# EAGLE design base_rs232 (EAGLE 4.09)
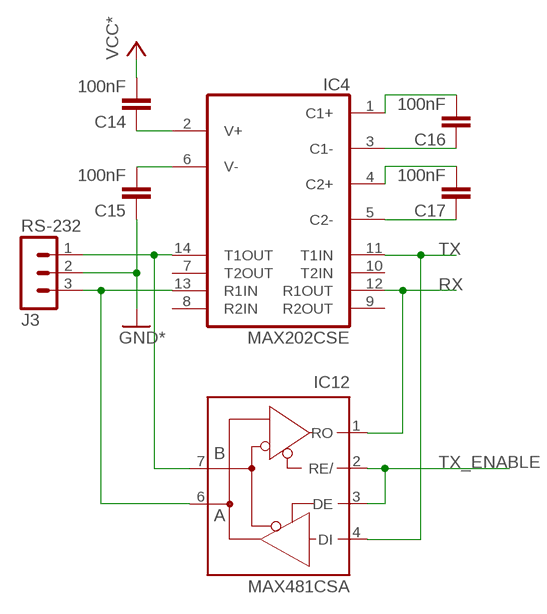
[diagram p0: schematic, sheet 1]

## Parts
C14  100nF  C-EUC0805  [C0805]
C15  100nF  C-EUC0805  [C0805]
C16  100nF  C-EUC0805  [C0805]
C17  100nF  C-EUC0805  [C0805]
IC4  MAX202CSE  [SO16]
IC12  MAX481CSA  [SO08]
J3  RS-232  MA03-1  [MA03-1]

## Nets
GND: C15.2 J3.2 ; supply symbol labelled GND*
LCD_NEG: C15.1 IC4.6(V-)
N$12: IC4.14(T1OUT) IC12.7(B) J3.1
N$16: IC4.13(R1IN) IC12.6(A) J3.3
N$18: C16.2 IC4.3(C1-)
N$20: C17.2 IC4.5(C2-)
N$21: C17.1 IC4.4(C2+)
N$22: C14.2 IC4.2(V+)
N$49: C16.1 IC4.1(C1+)
RX: IC4.12(R1OUT) IC12.1(RO)
TX: IC4.11(T1IN) IC12.4(DI)
TX_ENABLE: IC12.2(RE/) IC12.3(DE)
VCC: C14.1 ; supply symbol labelled VCC*
Unconnected: IC4.7(T2OUT) IC4.8(R2IN) IC4.9(R2OUT) IC4.10(T2IN)

## Power pins joined to a net without a drawn wire
GND: IC4.15(GND) IC12.5(GND)
VCC: IC4.16(VCC) IC12.8(VCC)

## Library data of the parts
C14-C17 = rcl:C-EU: CAPACITOR, European symbol
IC4 = maxim:MAX202C
IC12 = maxim:MAX481CSA: RS485 TRANSEIVER
J3 = CON-LSTB:MA03-1: PIN HEADER

## Board
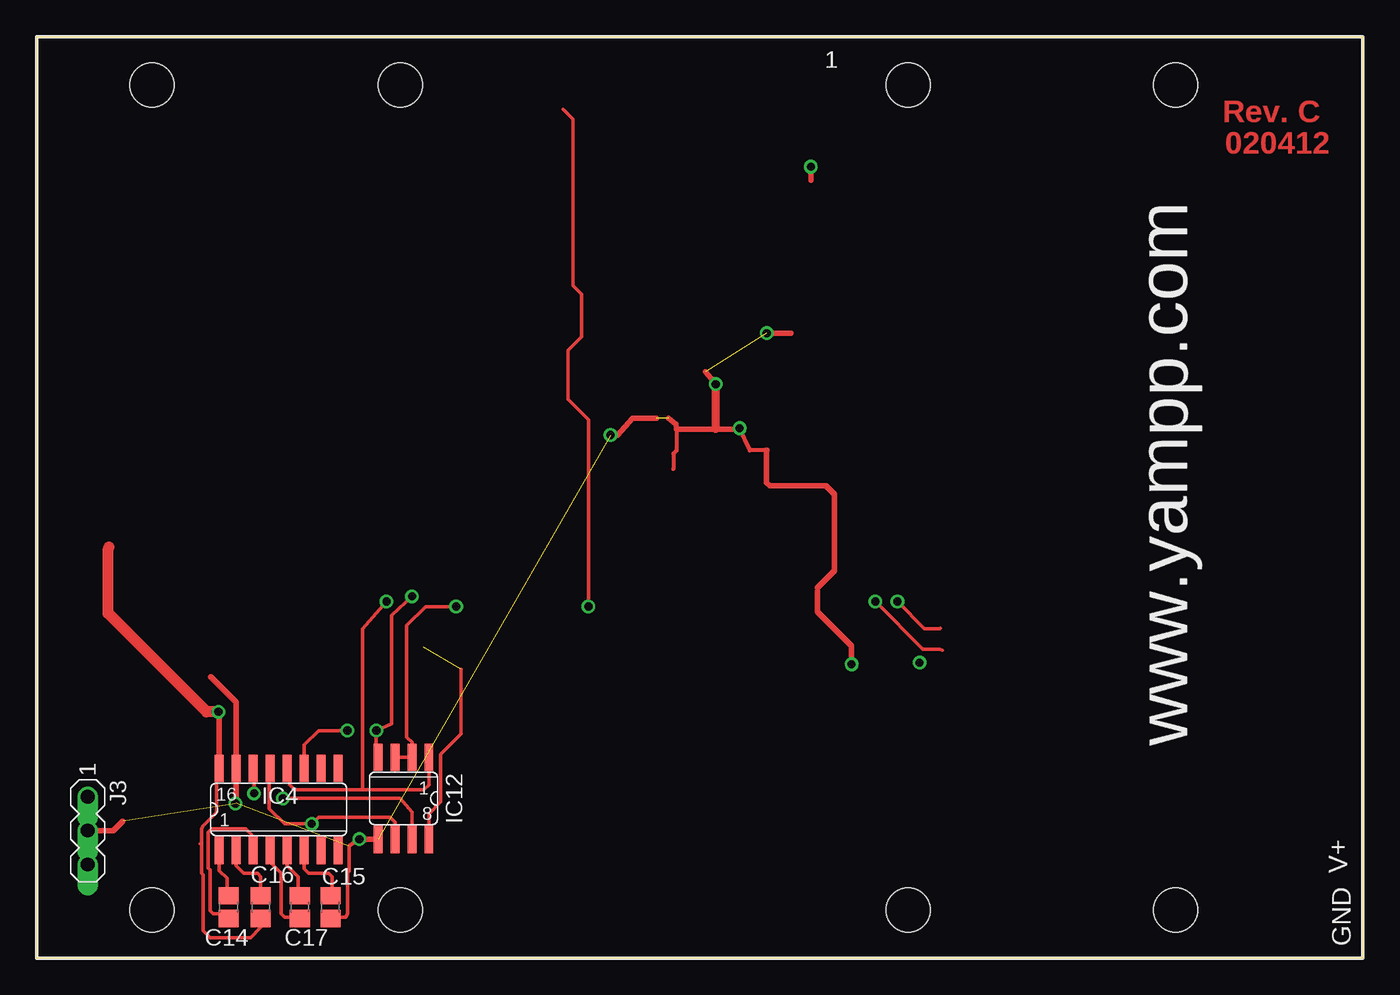
[diagram p1: board, top side]
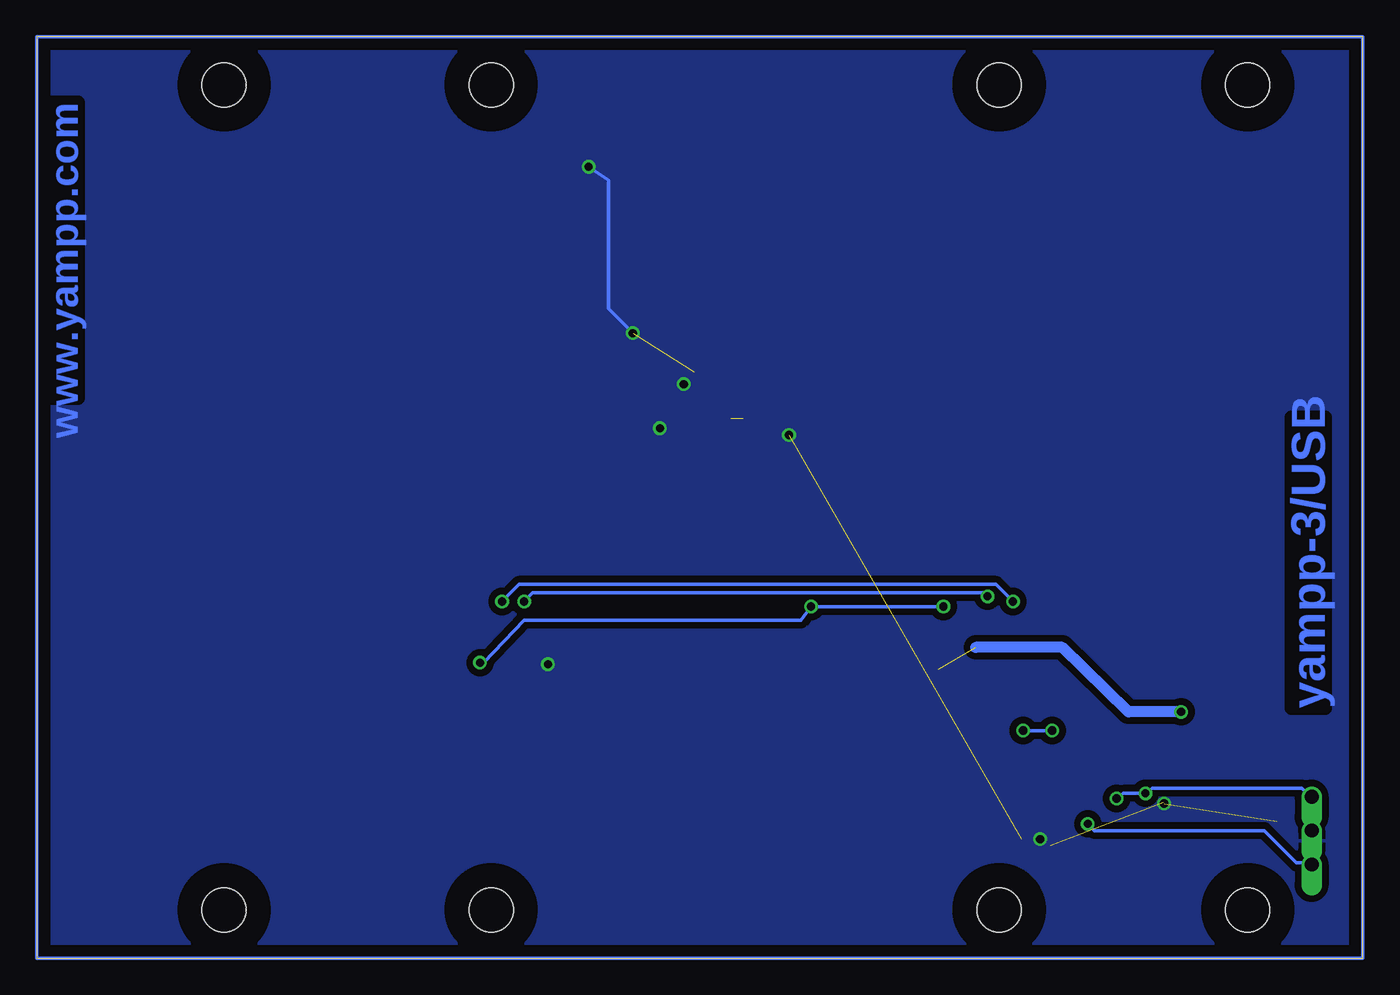
[diagram p2: board, bottom side, seen from below]

Size 99.2 x 68.9 mm. Coordinates in mm from the lower left corner, seen from the top.
Outline: 0,0 0,68.9 99.2,68.9 99.2,0 0,0
Copper layers used: Top, Bottom
Holes 3.3 mm at 85.2,3.6 65.2,3.6 27.2,3.6 8.6,3.6 85.2,65.3 65.2,65.3 27.2,65.3 8.6,65.3
tRestrict: area 6.9,63.6 to 10.3,67; area 25.5,63.6 to 28.9,67; area 63.5,63.6 to 66.9,67; area 83.5,63.6 to 86.9,67; area 83.5,1.9 to 86.9,5.3; area 63.5,1.9 to 66.9,5.3; area 25.5,1.9 to 28.9,5.3; area 6.9,1.9 to 10.3,5.3
bRestrict: area 6.9,63.6 to 10.3,67; area 25.5,63.6 to 28.9,67; area 63.5,63.6 to 66.9,67; area 83.5,63.6 to 86.9,67; area 83.5,1.9 to 86.9,5.3; area 63.5,1.9 to 66.9,5.3; area 25.5,1.9 to 28.9,5.3; area 6.9,1.9 to 10.3,5.3

### Footprints (pad centres in the part's own frame; a part is rotated, then mirrored left to right if it is on the bottom)
C0805 = smd 1.3 x 1.5: 1 -0.85,0; 2 0.85,0
SO16 = smd 0.66 x 2.032: 1 -4.445,-3.073; 2 -3.175,-3.073; 3 -1.905,-3.073; 4 -0.635,-3.073; 5 0.635,-3.073; 6 1.905,-3.073; 7 3.175,-3.073; 8 4.445,-3.073; 9 4.445,3.073; 10 3.175,3.073; 11 1.905,3.073; 12 0.635,3.073; 13 -0.635,3.073; 14 -1.905,3.073; 15 -3.175,3.073; 16 -4.445,3.073
SO08 = smd 0.66 x 2.032: 1 -1.905,-3.073; 2 -0.635,-3.073; 3 0.635,-3.073; 4 1.905,-3.073; 5 1.905,3.073; 6 0.635,3.073; 7 -0.635,3.073; 8 -1.905,3.073
MA03-1 = drill 1.016 offset: 1 -2.54,0; 2 0,0; 3 2.54,0

### Placement (x,y rotation side)
C14  16.76,3.81 90 top
C15  21.97,3.81 270 top
C16  14.35,3.81 270 top
C17  19.68,3.81 90 top
IC4  18.1,11.11 0 top
IC12  27.43,11.94 180 top
J3  3.81,9.53 270 top

### Tracks (layer width: path | path; a pad name or v marks a point on that pad's centre or on a via)
GND  (via drill 0.61)  (5 unrouted)
  Top 0.254: v14.86,11.56 14.92,11.62 | 47.62,36.58 47.62,36.62 | v50.8,42.93 50.91,42.53 | v24.13,8.89 23.37,8.38 23.37,6.48 23.24,6.35 23.24,3.3 23.11,3.05 22.1,3.05 22.19,2.96 C15.2 | 12.99,21.05 12.95,21.08 | 25.53,8.13 IC12.5 25.53,8.89 | 58.42,27.69 58.42,27.43 58.42,27.28 | 54.61,37.97 54.62,37.97
  Top 0.305: v52.58,39.62 53.35,37.97 54.57,37.97 | 47.62,36.58 47.62,37.72 47.88,37.97 47.88,39.62
  Top 0.406: 14.92,11.62 IC4.15 14.92,19.11 12.99,21.05 | v54.61,46.74 56.44,46.74 | 47.87,39.55 50.8,39.56 52.64,39.56 v52.58,39.62 | 54.62,37.97 54.57,37.97 | 47.87,39.55 47.88,39.62 | v57.91,59.18 57.91,58.17 | 47.87,39.55 47.82,39.94 47.26,40.37 | v24.13,8.89 25.53,8.89 | 58.42,27.69 59.69,28.96 59.69,34.67 59.05,35.31 54.86,35.31 54.61,35.56 54.61,37.97 | v50.8,42.93 50.02,43.83 | v60.96,21.97 60.96,23.37 58.42,25.91 58.42,27.43 | 6.44,10.25 5.71,9.53 J3.2 | v42.93,39.12 43.43,39.12 44.58,40.39 46.35,40.39
  Top 0.61: 50.8,39.56 v50.8,42.93
  Bottom 0.254: v54.61,46.74 56.44,48.56 56.44,58.17 v57.91,59.18 | v50.8,42.93 50.93,42.8
  pour Bottom (isolate 0.508): -1.02,-0.89 -1.02,70.23 100.08,69.98 100.08,-1.02
LCD_NEG
  Top 0.254: IC4.6 20,6.67 20.32,6.35 21.84,6.35 22.1,6.1 22.1,4.57 22.19,4.66 C15.1
N$11
  Bottom 0.254: 0,0 0,68.9 99.2,68.9 99.2,0 0,0
N$12  (via drill 0.61)
  Top 0.254: IC4.14 16.22,14.19 16.26,14.22 v16.26,12.32 | v18.41,11.94 27.18,11.94 28.07,10.92 IC12.7
  Bottom 0.254: J3.1 3.81,11.94 4.57,12.7 15.75,12.7 v16.26,12.32 17.91,12.32 v18.41,11.94
N$15
  Top 0.254: 0,0 0,68.9 99.2,68.9 99.2,0 0,0
N$16  (via drill 0.61)
  Top 0.254: IC12.6 26.8,10.16 26.42,10.54 21.08,10.54 v20.57,10.03 18.54,10.03 17.4,11.18 17.4,13.97 17.53,14.1 17.46,14.16 IC4.13
  Bottom 0.254: v20.57,10.03 20.07,9.53 7.37,9.53 4.95,7.11 3.81,7.11 J3.3
N$18
  Top 0.254: IC4.3 16.07,9.21 15.62,9.65 13.08,9.65 12.83,9.4 12.83,6.73 12.95,6.6 12.95,3.56 13.21,3.3 14.22,3.3 14.22,3.05 14.14,2.96 C16.2
N$20
  Top 0.254: IC4.5 18.73,6.92 19.56,6.1 19.56,4.57 19.65,4.66 C17.2
N$21
  Top 0.254: IC4.4 17.46,7.18 18.29,6.35 18.29,3.3 18.54,3.05 19.56,3.05 19.65,2.96 C17.1
N$22
  Top 0.254: IC4.2 14.92,6.92 15.49,6.35 16.51,6.35 16.76,6.1 C14.2
N$49
  Top 0.254: IC4.1 13.65,6.54 14.22,5.97 14.22,4.57 14.14,4.66 C16.1
RX  (via drill 0.61)
  Top 0.254: 24.38,12.57 24.38,24.64 v26.16,26.67 | 67.59,24.66 67.56,24.64 66.42,24.64 v64.39,26.67 | 24.38,12.57 19.3,12.57 18.92,12.95 18.92,14.1 18.76,14.19 | 18.76,14.19 IC4.12 | 18.76,14.19 18.8,14.22 | IC12.1 29.34,12.95 28.96,12.57 24.38,12.57
  Bottom 0.254: v26.16,26.67 27.43,27.94 63.12,27.94 v64.39,26.67
TX  (via drill 0.61)
  Top 0.254: 67.74,23.04 67.56,23.11 66.29,23.11 v62.74,26.67 | IC12.4 25.4,16 v25.4,17.02 26.54,17.53 26.54,25.65 v28.07,27.05 | 20.07,14.1 20,14.16 IC4.11 20,15.94 21.08,17.02 v23.24,17.02
  Bottom 0.254: v28.07,27.05 28.32,27.3 62.1,27.3 v62.74,26.67 | v23.24,17.02 v25.4,17.02
TX_ENABLE  (via drill 0.61)
  Top 0.254: IC12.2 26.82,15.01 26.8,14.22 | v66.04,22.1 66.22,22.3 | v41.27,26.29 41.27,40.26 39.75,41.78 39.75,45.47 40.77,46.48 40.77,49.66 40.13,50.29 40.13,62.74 39.37,63.5 | IC12.3 26.8,14.22 | 26.8,14.22 26.8,14.1 | 26.8,14.22 26.67,14.35 | v31.37,26.29 29.08,26.29 27.69,24.89 27.69,16.51 28.07,16.13 IC12.2 | IC12.2 28.07,14.22
  Bottom 0.254: v66.04,22.1 65.79,22.1 62.74,25.27 42.04,25.27 v41.27,26.29 v31.37,26.29
VCC  (via drill 0.61)  (1 unrouted)
  Top 0.254: C14.1 16.76,2.29 16,1.52 12.95,1.52 12.45,2.03 12.45,6.22 12.32,6.35 12.32,8.51 | 12.32,8.51 12.32,9.65 12.45,9.91 13.46,10.92 13.46,13.72 13.72,13.97 13.65,14.03 IC4.16 | IC12.8 29.34,10.79 30.23,11.68 30.23,15.24 31.75,16.76 31.75,21.59 | 12.32,8.51 12.23,8.55
  Top 0.406: IC4.16 13.65,18.1 v13.59,18.41
  Top 0.813: 5.38,30.73 5.33,30.48 5.33,25.78 12.7,18.41 v13.59,18.41
  Bottom 0.813: v13.59,18.41 17.53,18.41 22.48,23.24 28.96,23.24

### Text on the board
Top: Rev. C | 020412
Bottom: www.yampp.com | yampp-3/USB
tPlace: 1 | www.yampp.com | V+ | GND